# Altium schematic sheet Channel.SchDoc: CDR, Fanout, D-FF
size 420 x 297 mm; CheckedBy: E.Orzes F.Martina S.Baron; CompanyName: CERN; DrawnBy: E.Orzes; Organization: CERN; Address1: European Organization for Nuclear Research; Address2: CH-1211 Genève 23 - Switzerland; SheetNumber: 5; SheetTotal: 6; Projet: Phase Stable Link; DivGrp: EP-ESE; Designer: E.Orzes; ModifiedDate: -
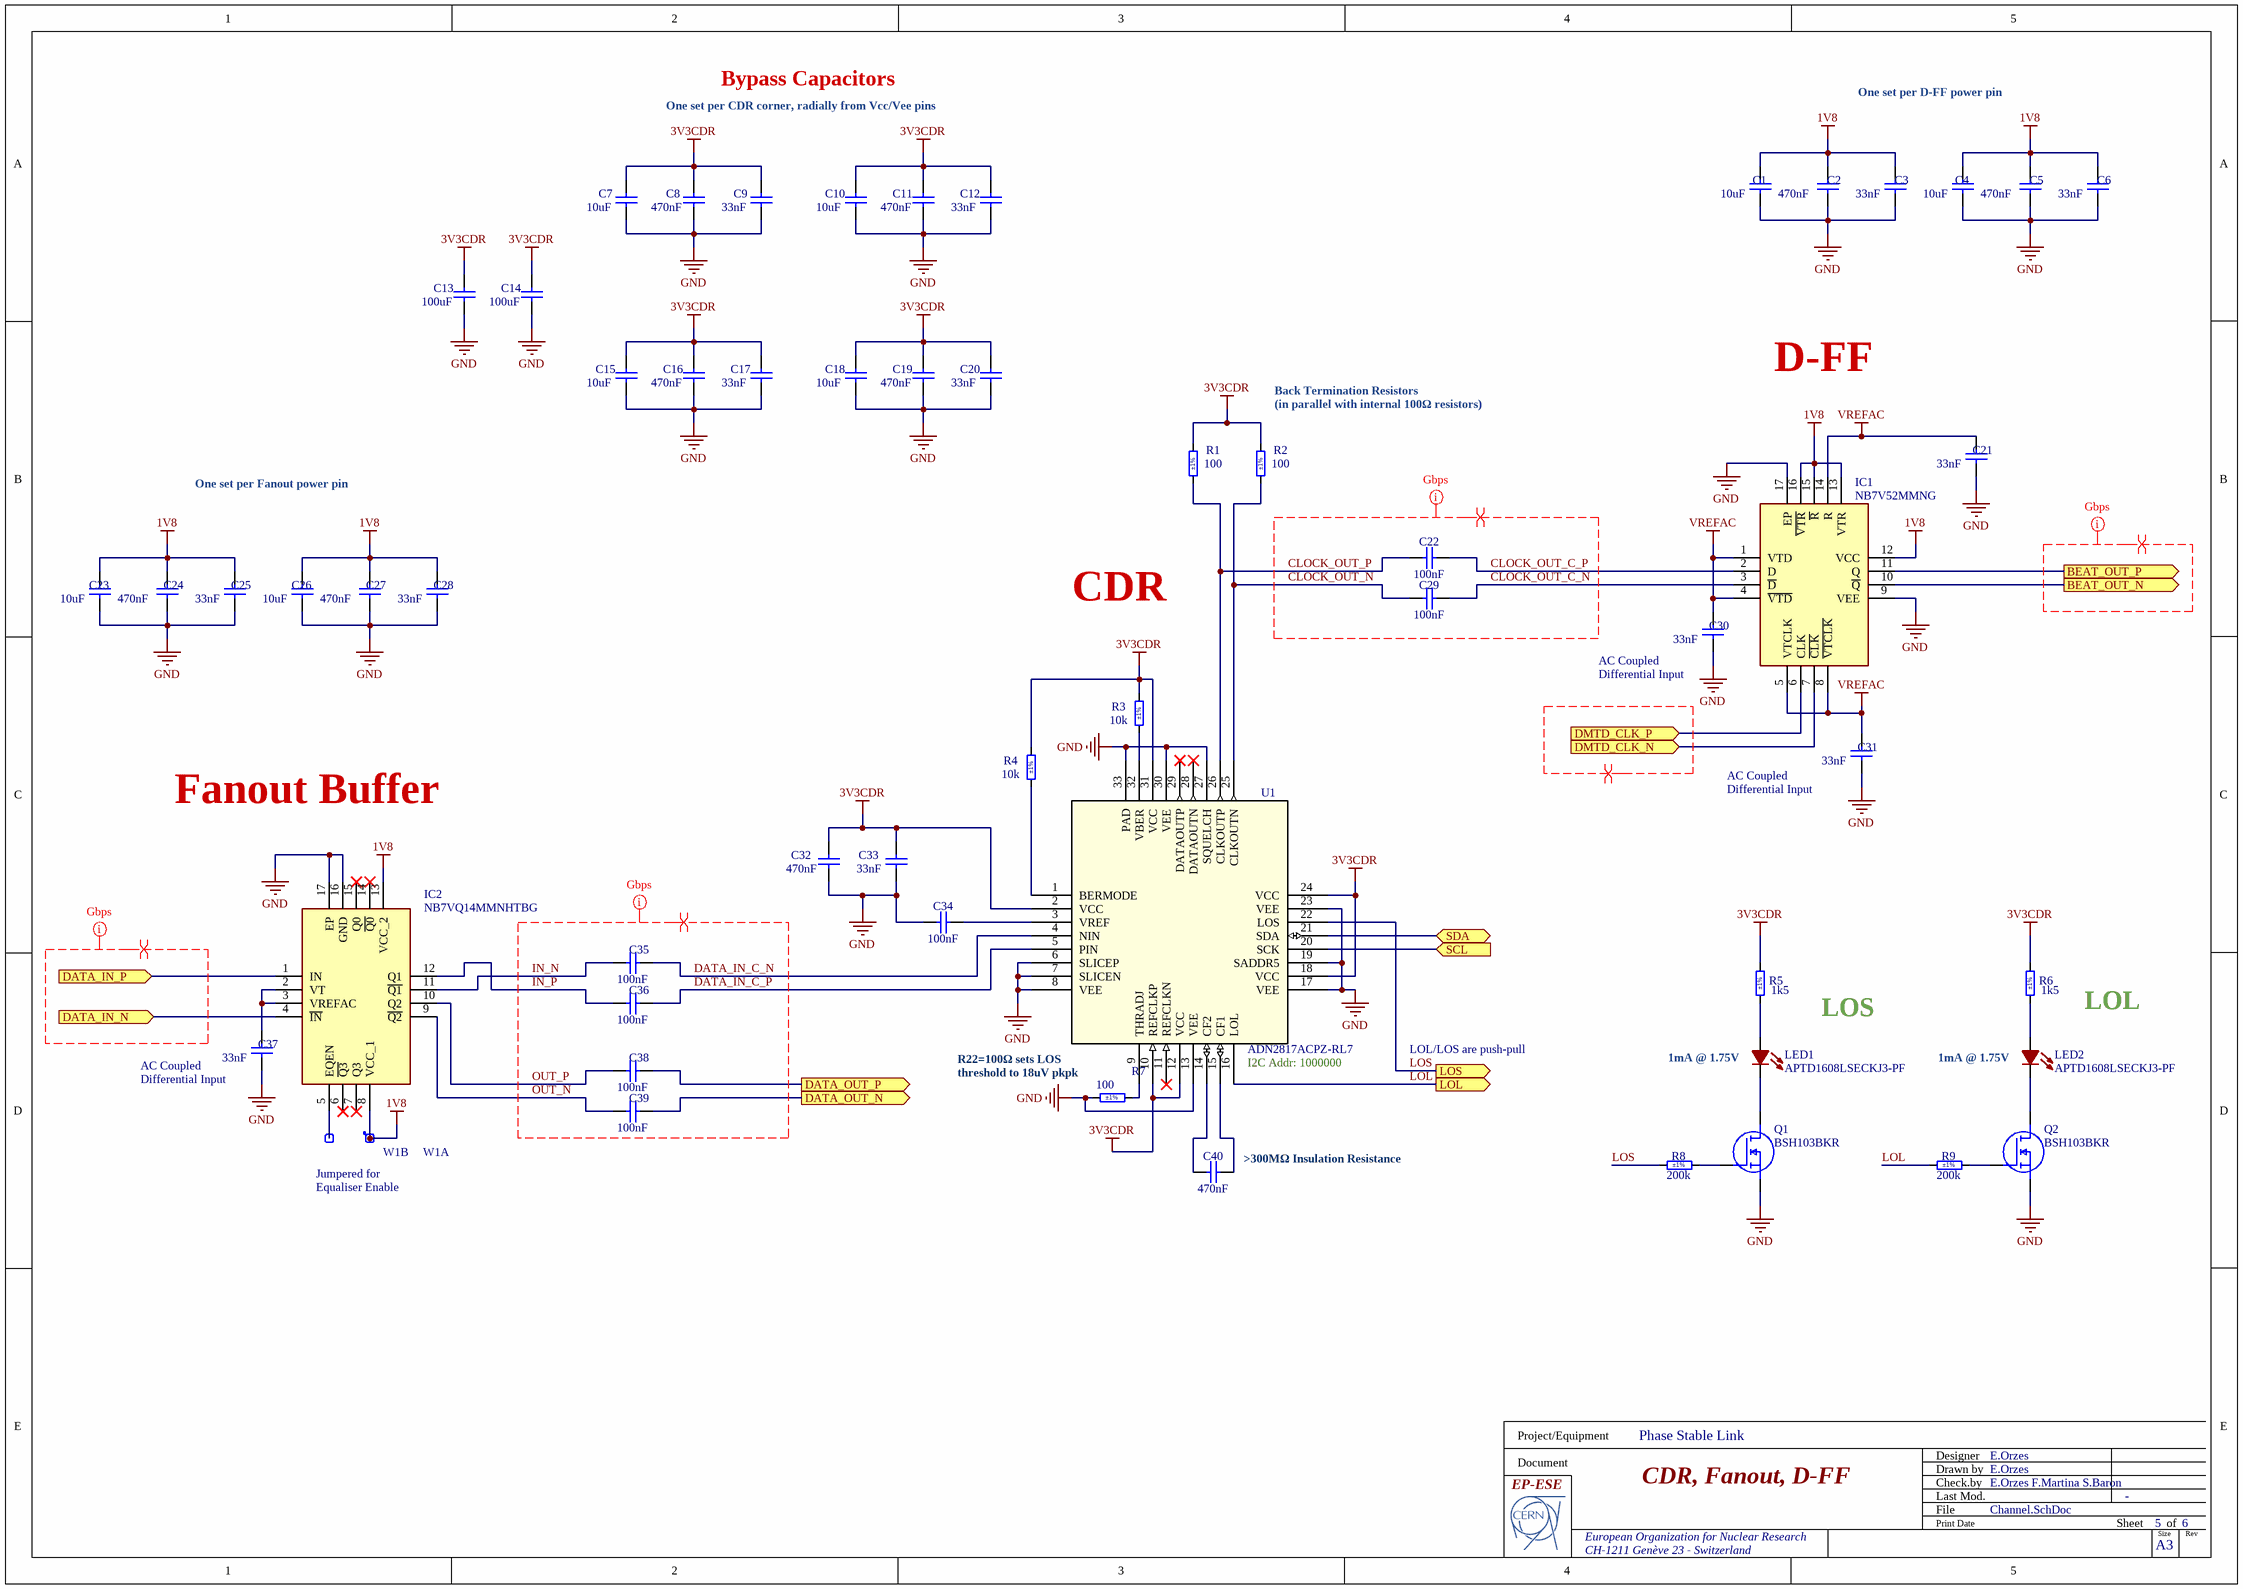
[diagram p0: Channel.SchDoc]

## Parts
C1  10uF  [CAPC1608X87N]
C2  470nF  [CAPC0510X04N]
C3  33nF  [LLL03TR61E333KE01]
C4  10uF  [CAPC1608X87N]
C5  470nF  [CAPC0510X04N]
C6  33nF  [LLL03TR61E333KE01]
C7  10uF  [CAPC1608X87N]
C8  470nF  [CAPC0510X04N]
C9  33nF  [LLL03TR61E333KE01]
C10  10uF  [CAPC1608X87N]
C11  470nF  [CAPC0510X04N]
C12  33nF  [LLL03TR61E333KE01]
C13  100uF  [CAPC3225X270N]
C14  100uF  [CAPC3225X270N]
C15  10uF  [CAPC1608X87N]
C16  470nF  [CAPC0510X04N]
C17  33nF  [LLL03TR61E333KE01]
C18  10uF  [CAPC1608X87N]
C19  470nF  [CAPC0510X04N]
C20  33nF  [LLL03TR61E333KE01]
C21  33nF  [LLL03TR61E333KE01]
C22  100nF  [CAPC0603X33N]
C23  10uF  [CAPC1608X87N]
C24  470nF  [CAPC0510X04N]
C25  33nF  [LLL03TR61E333KE01]
C26  10uF  [CAPC1608X87N]
C27  470nF  [CAPC0510X04N]
C28  33nF  [LLL03TR61E333KE01]
C29  100nF  [CAPC0603X33N]
C30  33nF  [LLL03TR61E333KE01]
C31  33nF  [LLL03TR61E333KE01]
C32  470nF  [CAPC0510X04N]
C33  33nF  [LLL03TR61E333KE01]
C34  100nF  [CAPC0603X33N]
C35  100nF  [CAPC0603X33N]
C36  100nF  [CAPC0603X33N]
C37  33nF  [LLL03TR61E333KE01]
C38  100nF  [CAPC0603X33N]
C39  100nF  [CAPC0603X33N]
C40  470nF  [CAPC2013X140N]
IC1  NB7V52MMNG  [QFN50P300X300X100-17N]
IC2  NB7VQ14MMNHTBG  [QFN50P300X300X100-17N]
LED1  APTD1608LSECKJ3-PF  [LED_APTD1608LSECKJ3-PF_KNB]
LED2  APTD1608LSECKJ3-PF  [LED_APTD1608LSECKJ3-PF_KNB]
Q1  BSH103BKR  [SOT95P230X110-3N]
Q2  BSH103BKR  [SOT95P230X110-3N]
R1  100  Tolerance: ±1%  [RESC0603X28N]
R2  100  Tolerance: ±1%  [RESC0603X28N]
R3  10k  Tolerance: ±1%  [RESC1005X40N]
R4  10k  Tolerance: ±1%  [RESC1005X40N]
R5  1k5  Tolerance: ±1%  [RESC1005X40N]
R6  1k5  Tolerance: ±1%  [RESC1005X40N]
R7  100  Tolerance: ±1%  [RESC0603X28N]
R8  200k  Tolerance: ±1%  [RESC1005X40N]
R9  200k  Tolerance: ±1%  [RESC1005X40N]
U1  ADN2817ACPZ-RL7  [CP_32_11_ADI]
W1  Header 2  [SAMTEC_HTSW-102-23-L-S]  (value not drawn)  (parts A,B of 2)

## Ports
BEAT_OUT_N (out), BEAT_OUT_P (out), DATA_IN_N (in), DATA_IN_P (in), DATA_OUT_N (out), DATA_OUT_P (out), DMTD_CLK_N (in), DMTD_CLK_P (in), LOL (out), LOS (out), SCL (in), SDA (bidir)

## Nets
1V8: C1.2 C2.2 C3.2 C4.2 C5.2 C6.2 C23.2 C24.2 C25.2 C26.2 C27.2 C28.2 IC1.12(VCC) IC1.13(VTR) IC1.15(~{R}) IC1.16(~{VTR}) IC2.8(VCC_1) IC2.13(VCC_2) W1.1
3V3CDR: C7.2 C8.2 C9.2 C10.2 C11.2 C12.2 C13.2 C14.2 C15.2 C16.2 C17.2 C18.2 C19.2 C20.2 C32.2 C33.2 R1.2 R2.2 R3.2 R4.2 R5.2 R6.2 U1.2(VCC) U1.10(REFCLKP) U1.12(VCC) U1.18(VCC) U1.24(VCC) U1.31(VCC)
GND: C1.1 C2.1 C3.1 C4.1 C5.1 C6.1 C7.1 C8.1 C9.1 C10.1 C11.1 C12.1 C13.1 C14.1 C15.1 C16.1 C17.1 C18.1 C19.1 C20.1 C21.1 C23.1 C24.1 C25.1 C26.1 C27.1 C28.1 C30.1 C31.1 C32.1 C33.1 C34.1 C37.1 IC1.9(VEE) IC1.17(EP) IC2.16(GND) IC2.17(EP) Q1.2(S) Q2.2(S) R7.1 U1.6(SLICEP) U1.7(SLICEN) U1.8(VEE) U1.13(VEE) U1.17(VEE) U1.19(SADDR5) U1.23(VEE) U1.27(SQUELCH) U1.30(VEE) U1.33(PAD)
VREFAC: C21.2 C30.2 C31.2 IC1.1(VTD) IC1.4(~{VTD}) IC1.5(VTCLK) IC1.8(~{VTCLK}) IC1.14(R)
BEAT_OUT_N: IC1.10(~{Q}) ; port BEAT_OUT_N
BEAT_OUT_P: IC1.11(Q) ; port BEAT_OUT_P
CLOCK_OUT_C_N: C29.2 IC1.3(~{D})
CLOCK_OUT_C_P: C22.2 IC1.2(D)
CLOCK_OUT_N: C29.1 R2.1 U1.25(CLKOUTN)
CLOCK_OUT_P: C22.1 R1.1 U1.26(CLKOUTP)
DATA_IN_C_N: C35.2 U1.4(NIN)
DATA_IN_C_P: C36.2 U1.5(PIN)
DATA_IN_N: IC2.4(~{IN}) ; port DATA_IN_N
DATA_IN_P: IC2.1(IN) ; port DATA_IN_P
DATA_OUT_N: C39.2 ; port DATA_OUT_N
DATA_OUT_P: C38.2 ; port DATA_OUT_P
DMTD_CLK_N: IC1.7(~{CLK}) ; port DMTD_CLK_N
DMTD_CLK_P: IC1.6(CLK) ; port DMTD_CLK_P
IN_N: C35.1 IC2.11(~{Q1})
IN_P: C36.1 IC2.12(Q1)
LOL: R9.1 U1.16(LOL) ; port LOL
LOS: R8.1 U1.22(LOS) ; port LOS
OUT_N: C39.1 IC2.9(~{Q2})
OUT_P: C38.1 IC2.10(Q2)
SCL: U1.20(SCK) ; port SCL
SDA: U1.21(SDA) ; port SDA
NetC34_2: C34.2 U1.3(VREF)
NetC37_2: C37.2 IC2.2(VT) IC2.3(VREFAC)
NetC40_1: C40.1 U1.14(CF2)
NetC40_2: C40.2 U1.15(CF1)
NetIC2_5: IC2.5(EQEN) W1.2
NetLED1_1: LED1.1(C) Q1.3(D)
NetLED1_2: LED1.2(A) R5.1
NetLED2_1: LED2.1(C) Q2.3(D)
NetLED2_2: LED2.2(A) R6.1
NetQ1_1: Q1.1(G) R8.2
NetQ2_1: Q2.1(G) R9.2
NetR3_1: R3.1 U1.32(VBER)
NetR4_1: R4.1 U1.1(BERMODE)
NetR7_2: R7.2 U1.9(THRADJ)

Not connected (* = marked no-connect by the designer): IC2 6(~{Q3})* 7(Q3)* 14(~{Q0})* 15(Q0)*; U1 11(REFCLKN)* 28(DATAOUTN)* 29(DATAOUTP)*

## Layout directives
differential pair: (no net found under the mark), CLOCK_OUT_C_N, CLOCK_OUT_C_P, CLOCK_OUT_N, CLOCK_OUT_P, DATA_IN_C_N, DATA_IN_C_P, IN_N, IN_P, OUT_N, OUT_P
mark named Gbps: (no net found under the mark), CLOCK_OUT_C_N, CLOCK_OUT_C_P, CLOCK_OUT_N, CLOCK_OUT_P, DATA_IN_C_N, DATA_IN_C_P, IN_N, IN_P, OUT_N, OUT_P

## Notes on the sheet
- Bypass Capacitors
- One set per CDR corner, radially from Vcc/Vee pins
- One set per D-FF power pin
- D-FF
- (near R2) Back Termination Resistors
  (in parallel with internal 100Ω resistors)
- One set per Fanout power pin
- CDR
- (near C30) AC Coupled
  Differential Input
- (near C31) AC Coupled
  Differential Input
- Fanout Buffer
- (near U1) R22=100Ω sets LOS threshold to 18uV pkpk
- (near U1) I2C Addr: 1000000
- LOL/LOS are push-pull
- (near LED1) 1mA @ 1.75V
- LOS
- (near LED2) 1mA @ 1.75V
- LOL
- (near C37) AC Coupled
  Differential Input
- (near W1) Jumpered for Equaliser Enable
- (near C40) >300MΩ Insulation Resistance
- Project/Equipment
- Document
- Designer
- Drawn by
- Check.by
- File
- Last Mod.
- Print Date
- Sheet
- Size
- A3
- of
- Rev

## Library data of the parts
C1 C4 C7 C10 C15 C18 C23 C26 = CC0603_10UF_6.3V_20%_X5R: GRM188D71A106KA73; Part Description: SMD Multilayer Chip Ceramic Capacitor; Manufacturer: GENERIC; Manufacturer1 Part Number: C0603C106M9PAC; Voltage: 6.3V; TC: X5R; Tolerance: ±20%; Part Number: CC0603_10UF_6.3V_20%_X5R; Component Kind: Standard; Component Type: Standard; Pin Count: 2; Value: 10uF; Status: Preferred; Manufacturer Part Number: CC0603_10uF_6.3V_20%_X5R; Case: 0603; Mounted: Yes; Socket: No; SMD: Yes; Sense: No; Manufacturer1 Example: KEMET; Manufacturer1 ComponentHeight: 0.95mm; HelpURL: \\cern.ch\dfs\Applications\Altium\Datasheets\CC0603_X5R_KEMET.pdf; Author: CERN DEM JLC; CreateDate: 03/12/2007; LatestRevisionDate: 03/12/2007
C2 C5 C8 C11 C16 C19 C24 C27 C32 = Capacitor - non polarized: LLL153C70G474ME17; Value: 470nF
C3 C6 C9 C12 C17 C20 C21 C25 C28 C30 C31 C33 C37 = Capacitor - non polarized: LLL03TR61E333KE01; Value: 33nF
C13 C14 = CC1210_100UF_6.3V_20%_X7U: GRM32EC70J107ME15; Part Description: SMD Multilayer Chip Ceramic Capacitor; Manufacturer: GENERIC; Manufacturer1 Part Number: GRM32EE70J107ME15L; Voltage: 6.3V; TC: X7U; Tolerance: ±20%; Part Number: CC1210_100UF_6.3V_20%_X7U; Component Kind: Standard; Component Type: Standard; Pin Count: 2; Value: 100uF; Status: None; Manufacturer Part Number: CC1210_100UF_6.3V_20%_X7U; Case: 1210; Mounted: Yes; Socket: No; SMD: Yes; Sense: No; Manufacturer1 Example: MURATA; Manufacturer1 ComponentHeight: 2.7mm; HelpURL: \\cern.ch\dfs\Applications\Altium\Datasheets\CC1210_X7U_MURATA.pdf; Author: CERN DEM MR; CreateDate: 10/12/2017; LatestRevisionDate: 10/12/2017
C22 C29 C34-C36 C38 C39 = CC0201_100NF_6.3V_10%_X7R: Non-polarised capacitor; Part Description: SMD Multilayer Chip Ceramic Capacitor; Manufacturer: GENERIC; Manufacturer1 Part Number: CC0201KRX7R5BB104; Voltage: 6.3V; TC: X7R; Tolerance: ±10%; Part Number: CC0201_100NF_6.3V_10%_X7R; Component Kind: Standard; Component Type: Standard; Pin Count: 2; Value: 100nF; Status: Not Recommended; Manufacturer Part Number: CC0201_100NF_6.3V_10%_X7R; Case: 0201; Mounted: Yes; Socket: No; SMD: Yes; Sense: No; Manufacturer1 Example: YAGEO PHYCOMP; Manufacturer1 ComponentHeight: 0.33mm; HelpURL: \\cern.ch\dfs\Applications\Altium\Datasheets\CC0201_X7R_YAGEO_6.3VTO50V.pdf; Author: CERN DEM BC; CreateDate: 11/20/2020; LatestRevisionDate: 11/20/2020
C40 = CC0805_470NF_50V_10%_X7R_MURATA_GCM21BR71H474KA55L: GCM21BR71H474KA55L; Part Description: SMD Chip Monolithic Ceramic Capacitor for Automotive; Manufacturer: MURATA; Voltage: 50V; TC: X7R; Tolerance: ±10%; Part Number: CC0805_470NF_50V_10%_X7R_MURATA_GCM21BR71H474KA55L; Component Kind: Standard; Component Type: Standard; Pin Count: 2; Value: 470nF; Status: Not Recommended; Manufacturer Part Number: GCM21BR71H474KA55L; Case: 0805; Mounted: Yes; Socket: No; SMD: Yes; Sense: No; ComponentHeight: 1.4mm; HelpURL: \\cern.ch\dfs\Applications\Altium\Datasheets\CC0805_MURATA_GCM21BR71H474KA55L.pdf; Author: CERN DEM JLC; CreateDate: 5/10/2017; LatestRevisionDate: 5/10/2017
IC1 = NB7V52MMNG: Integrated Circuit; Manufacturer_Name: onsemi; Datasheet Link: https://www.onsemi.com/pdf/datasheet/nb7v52m-d.pdf; Height: 1mm; Manufacturer_Part_Number: NB7V52MMNG; Mouser Part Number: 863-NB7V52MMNG; Mouser Price/Stock: https://www.mouser.co.uk/ProductDetail/ON-Semiconductor/NB7V52MMNG?qs=N5dOQkml4H8i91m%252BmwlaUQ%3D%3D; Arrow Part Number: NB7V52MMNG; Arrow Price/Stock: https://www.arrow.com/en/products/nb7v52mmng/on-semiconductor
IC2 = NB7VQ14MMNHTBG: Integrated Circuit; Manufacturer_Name: onsemi; Datasheet Link: http://www.onsemi.com/pub/Collateral/NB7VQ14M-D.PDF; Height: 1mm; Manufacturer_Part_Number: NB7VQ14MMNHTBG; Mouser Part Number: 863-NB7VQ14MMNHTBG; Mouser Price/Stock: https://www.mouser.co.uk/ProductDetail/onsemi/NB7VQ14MMNHTBG?qs=3PKVEWFFm2%2FWq%2FFZ4xstfg%3D%3D; Arrow Part Number: NB7VQ14MMNHTBG; Arrow Price/Stock: https://www.arrow.com/en/products/nb7vq14mmnhtbg/on-semiconductor?utm_currency=USD&region=nac
LED1 LED2 = APTD1608LSECKJ3-PF: Led Red 0603 2mA 1.8V 50mcd 84mW; Mfr_Name: Kingbright
Q1 Q2 = BSH103BKR: MOSFET (N-Channel); Manufacturer_Name: Nexperia; Datasheet Link: https://ms.componentsearchengine.com/Datasheets/2/BSH103BKR.pdf; Height: 1.1mm; Manufacturer_Part_Number: BSH103BKR; Mouser Part Number: 771-BSH103BKR; Mouser Price/Stock: https://www.mouser.co.uk/ProductDetail/Nexperia/BSH103BKR?qs=GCAb4wyKXLKD%2FWt2ta8c7Q%3D%3D; Arrow Part Number: BSH103BKR; Arrow Price/Stock: https://www.arrow.com/en/products/bsh103bkr/nexperia?region=europe
R1 R2 R7 = R0201_100R_1%_0.05W_200PPM: Resistor - 1%; Part Description: Thick Film Chip Resistor; Manufacturer: GENERIC; Manufacturer1 Part Number: CRCW0201100RFNED; Power: 0.05W; TC: ±200ppm/°C; PressFit: No; Part Number: R0201_100R_1%_0.05W_200PPM; Component Kind: Standard; Component Type: Standard; Pin Count: 2; Value: 100; Status: Not Recommended; Manufacturer Part Number: R0201_100R_1%_0.05W_200PPM; Case: 0201; Mounted: Yes; Sense: No; Socket: No; SMD: Yes; Manufacturer1 Example: VISHAY; Manufacturer1 ComponentHeight: 0.27mm; HelpURL: \\cern.ch\dfs\Applications\Altium\Datasheets\R0201_VISHAY_CRCW e3.pdf; Author: CERN DEM JLC; CreateDate: 11/13/2014; LatestRevisionDate: 11/13/2014
R3 = R0402_10K_1%_0.0625W_100PPM: Resistor - 1%; Part Description: General Purpose Thick Film Chip Resistor; Manufacturer: GENERIC; Manufacturer1 Part Number: 232270671003L; TC: ±100ppm/°C; PressFit: No; Mounted: No; Part Number: R0402_10K_1%_0.0625W_100PPM; Component Kind: Standard; Component Type: Standard; Pin Count: 2; Value: 10k; Status: Not Recommended; Power: 0.0625W; Manufacturer Part Number: R0402_10K_1%_0.0625W_100PPM; Case: 0402; Sense: No; Socket: No; SMD: Yes; Manufacturer1 Example: YAGEO PHYCOMP; Manufacturer1 ComponentHeight: 0.4mm; HelpURL: \\cern.ch\dfs\Applications\Altium\Datasheets\R0402_Phycomp_RC0402.pdf; Author: CERN DEM JLC; CreateDate: 12/3/2007; LatestRevisionDate: 10/17/2012
R4 = R0402_10K_1%_0.0625W_100PPM: Resistor - 1%; Part Description: General Purpose Thick Film Chip Resistor; Manufacturer: GENERIC; Manufacturer1 Part Number: 232270671003L; TC: ±100ppm/°C; PressFit: No; Part Number: R0402_10K_1%_0.0625W_100PPM; Component Kind: Standard; Component Type: Standard; Pin Count: 2; Value: 10k; Status: Not Recommended; Power: 0.0625W; Manufacturer Part Number: R0402_10K_1%_0.0625W_100PPM; Case: 0402; Mounted: Yes; Sense: No; Socket: No; SMD: Yes; Manufacturer1 Example: YAGEO PHYCOMP; Manufacturer1 ComponentHeight: 0.4mm; HelpURL: \\cern.ch\dfs\Applications\Altium\Datasheets\R0402_Phycomp_RC0402.pdf; Author: CERN DEM JLC; CreateDate: 12/3/2007; LatestRevisionDate: 10/17/2012
R5 R6 = R0402_1K5_1%_0.0625W_100PPM: Resistor - 1%; Part Description: General Purpose Thick Film Chip Resistor; Manufacturer: GENERIC; Manufacturer1 Part Number: 232270671502L; TC: ±100ppm/°C; PressFit: No; Part Number: R0402_1K5_1%_0.0625W_100PPM; Component Kind: Standard; Component Type: Standard; Pin Count: 2; Value: 1k5; Status: Not Recommended; Power: 0.0625W; Manufacturer Part Number: R0402_1K5_1%_0.0625W_100PPM; Case: 0402; Mounted: Yes; Sense: No; Socket: No; SMD: Yes; Manufacturer1 Example: YAGEO PHYCOMP; Manufacturer1 ComponentHeight: 0.4mm; HelpURL: \\cern.ch\dfs\Applications\Altium\Datasheets\R0402_Phycomp_RC0402.pdf; Author: CERN DEM JLC; CreateDate: 12/3/2007; LatestRevisionDate: 10/17/2012
R8 R9 = R0402_200K_1%_0.0625W_100PPM: Resistor - 1%; Part Description: General Purpose Thick Film Chip Resistor; Manufacturer: GENERIC; Manufacturer1 Part Number: 232270672004L; TC: ±100ppm/°C; PressFit: No; Part Number: R0402_200K_1%_0.0625W_100PPM; Component Kind: Standard; Component Type: Standard; Pin Count: 2; Value: 200k; Status: Not Recommended; Power: 0.0625W; Manufacturer Part Number: R0402_200K_1%_0.0625W_100PPM; Case: 0402; Mounted: Yes; Sense: No; Socket: No; SMD: Yes; Manufacturer1 Example: YAGEO PHYCOMP; Manufacturer1 ComponentHeight: 0.4mm; HelpURL: \\cern.ch\dfs\Applications\Altium\Datasheets\R0402_Phycomp_RC0402.pdf; Author: CERN DEM JLC; CreateDate: 12/3/2007; LatestRevisionDate: 10/17/2012
U1 = ADN2817ACPZ-RL7: No Description Available; Mfr_Name: Analog Devices Inc; RefDes: RefDes; Type: Type
W1 = SAMTEC_HTSW-102-23-L-S: 2 Mini Wire-Wrap Contact Strip Header; Part Description: 2 Contacts, Pitch 2.54mm, Single Row  Through Mount Straight Header (Post Lead 5.84mm, Tail Lead 2.92mm, Insulator 2.54mm); Manufacturer: SAMTEC; PressFit: No; Status Comment: High Temperature; Part Number: SAMTEC_HTSW-102-23-L-S; Component Kind: Standard; Component Type: Standard; Pin Count: 2; Family: Header 2; Mounted: Yes; Socket: No; SMD: No; Sense: No; Status: Preferred; Manufacturer Part Number: HTSW-102-23-L-S; ComponentHeight: 8.38mm; HelpURL: \\cern.ch\dfs\Applications\Altium\Datasheets\SAMTEC_HTSW-102-23-L-S.pdf; Author: CERN DEM JLC; CreateDate: 2/22/2018; LatestRevisionDate: 2/22/2018